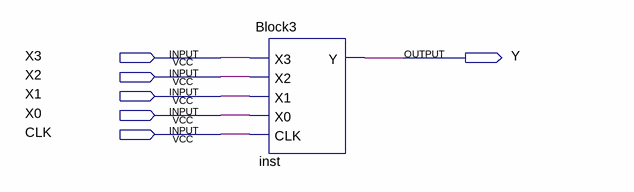
[diagram p0: schematic sheet]
// Quartus schematic Block4.bdf as structural Verilog: 1 symbols, 6 pins
module Block4 (
  input  X3,
  input  X2,
  input  X1,
  input  X0,
  input  CLK,
  output Y
);

  Block3 inst (.X3(X3), .X2(X2), .X1(X1), .X0(X0), .CLK(CLK), .Y(Y));
endmodule
